# EAGLE design supervisor (EAGLE 5.11)
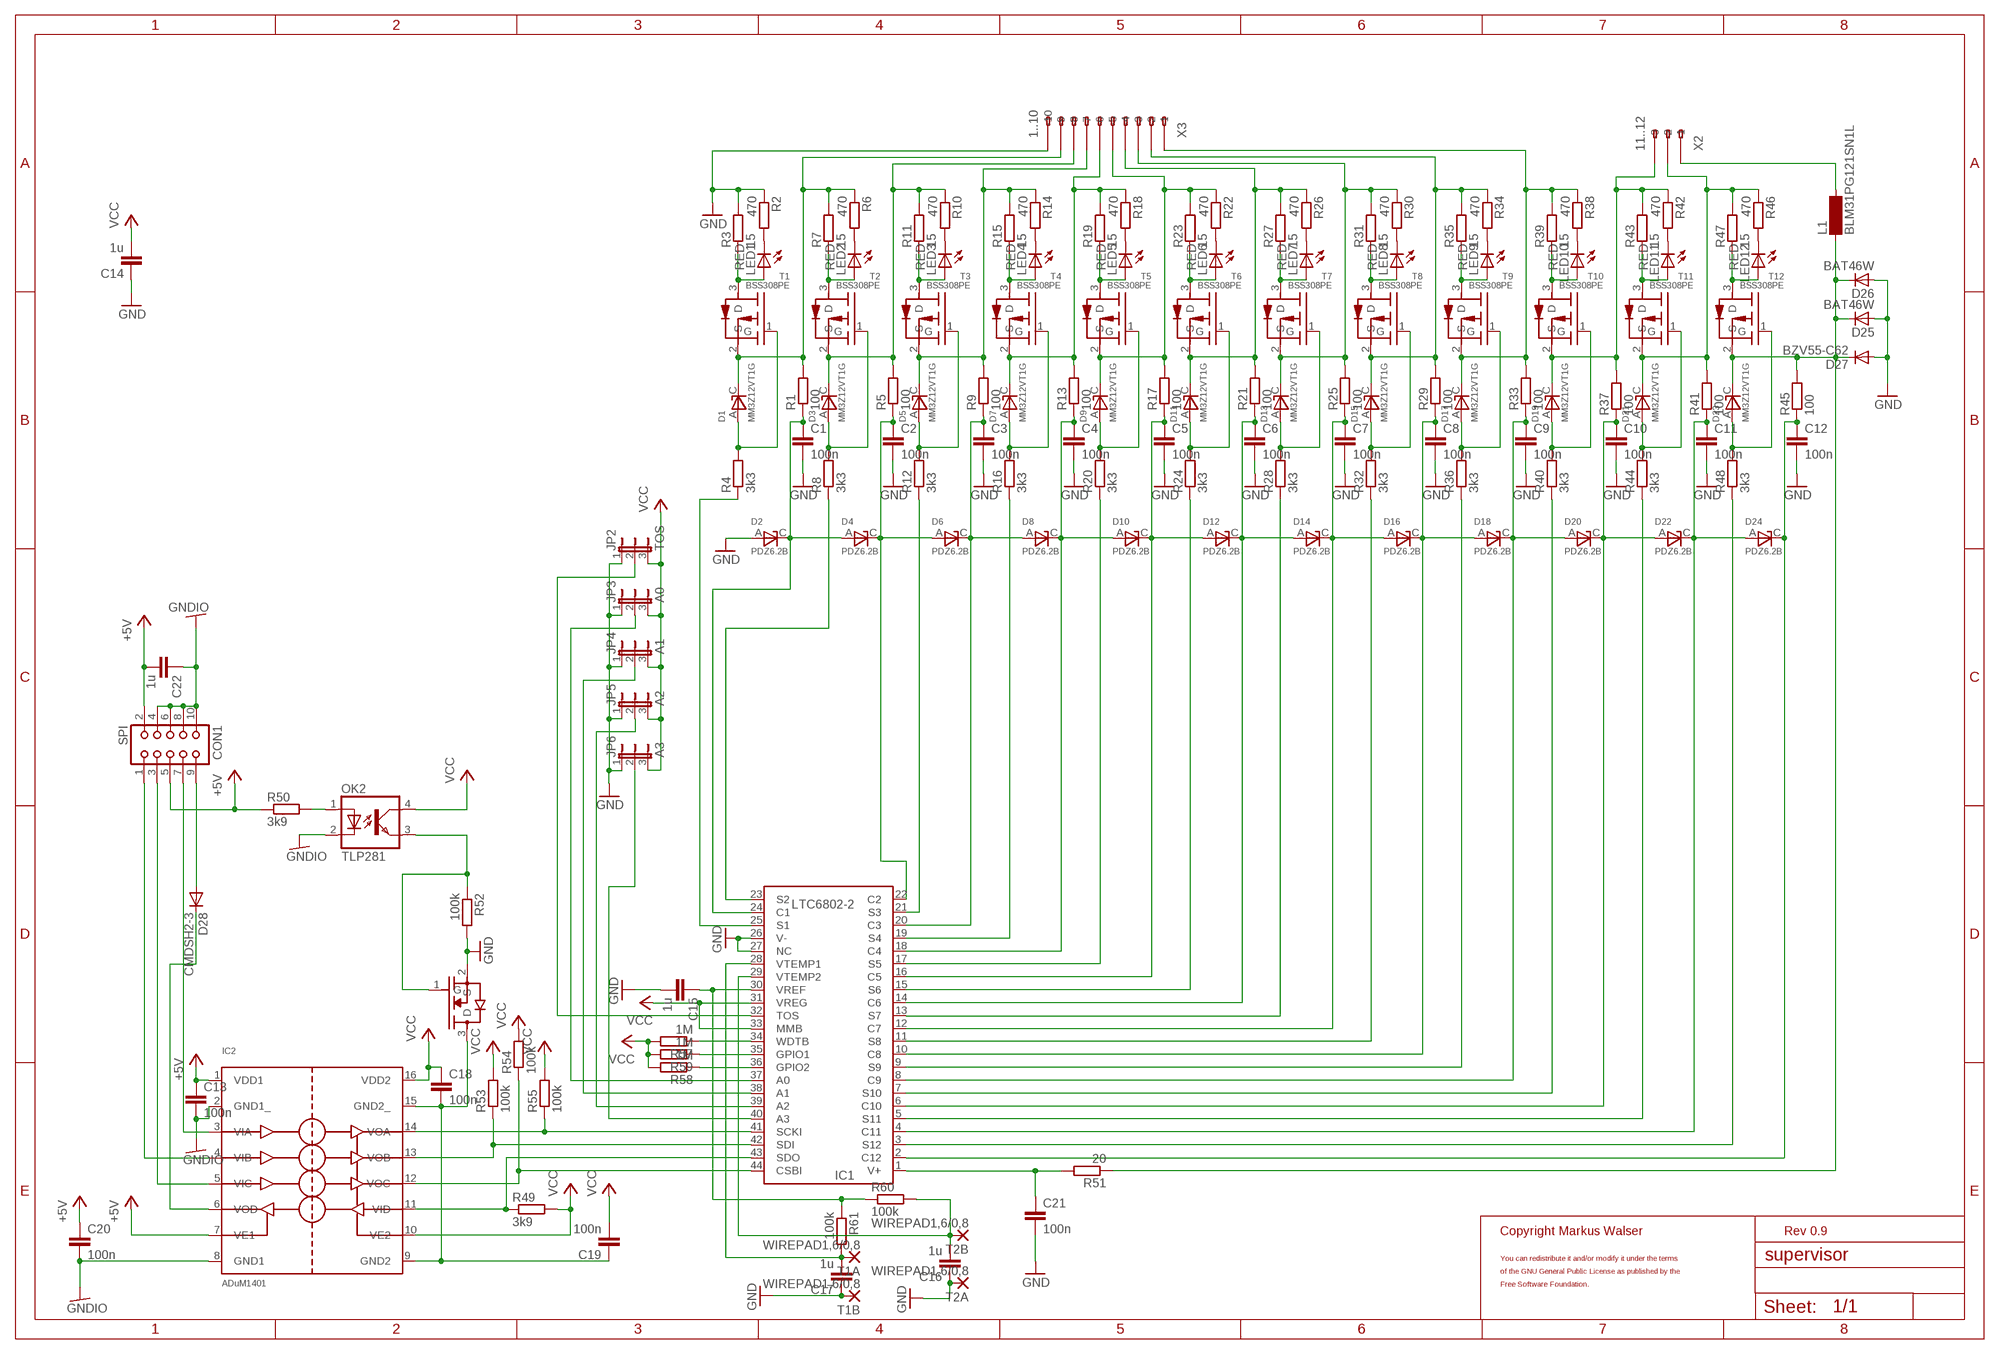
[diagram p0: schematic, sheet 1]

## Parts
C1  100n  C-EUC0603  [C0603]
C2  100n  C-EUC0603  [C0603]
C3  100n  C-EUC0603  [C0603]
C4  100n  C-EUC0603  [C0603]
C5  100n  C-EUC0603  [C0603]
C6  100n  C-EUC0603  [C0603]
C7  100n  C-EUC0603  [C0603]
C8  100n  C-EUC0603  [C0603]
C9  100n  C-EUC0603  [C0603]
C10  100n  C-EUC0603  [C0603]
C11  100n  C-EUC0603  [C0603]
C12  100n  C-EUC0603  [C0603]
C13  100n  C-EUC0603  [C0603]
C14  1u  C-EUC0603  [C0603]
C15  1u  C-EUC0603  [C0603]
C16  1u  C-EUC0603  [C0603]
C17  1u  C-EUC0603  [C0603]
C18  100n  C-EUC0603  [C0603]
C19  100n  C-EUC0603  [C0603]
C20  100n  C-EUC0603  [C0603]
C21  100n  C-EUC0603  [C0603]
C22  1u  C-EUC0603  [C0603]
CON1  SPI  CON10  [CON10]
D1  MM3Z12VT1G  MM3Z12VT1  [SOD323-R]
D2  PDZ6.2B  BZT52C6V2S  [SOD323-R]
D3  MM3Z12VT1G  MM3Z12VT1  [SOD323-R]
D4  PDZ6.2B  BZT52C6V2S  [SOD323-R]
D5  MM3Z12VT1G  MM3Z12VT1  [SOD323-R]
D6  PDZ6.2B  BZT52C6V2S  [SOD323-R]
D7  MM3Z12VT1G  MM3Z12VT1  [SOD323-R]
D8  PDZ6.2B  BZT52C6V2S  [SOD323-R]
D9  MM3Z12VT1G  MM3Z12VT1  [SOD323-R]
D10  PDZ6.2B  BZT52C6V2S  [SOD323-R]
D11  MM3Z12VT1G  MM3Z12VT1  [SOD323-R]
D12  PDZ6.2B  BZT52C6V2S  [SOD323-R]
D13  MM3Z12VT1G  MM3Z12VT1  [SOD323-R]
D14  PDZ6.2B  BZT52C6V2S  [SOD323-R]
D15  MM3Z12VT1G  MM3Z12VT1  [SOD323-R]
D16  PDZ6.2B  BZT52C6V2S  [SOD323-R]
D17  MM3Z12VT1G  MM3Z12VT1  [SOD323-R]
D18  PDZ6.2B  BZT52C6V2S  [SOD323-R]
D19  MM3Z12VT1G  MM3Z12VT1  [SOD323-R]
D20  PDZ6.2B  BZT52C6V2S  [SOD323-R]
D21  MM3Z12VT1G  MM3Z12VT1  [SOD323-R]
D22  PDZ6.2B  BZT52C6V2S  [SOD323-R]
D23  MM3Z12VT1G  MM3Z12VT1  [SOD323-R]
D24  PDZ6.2B  BZT52C6V2S  [SOD323-R]
D25  BAT46W  D-SOD123  [SOD123]
D26  BAT46W  D-SOD123  [SOD123]
D27  BZV55-C62  DIODE-MINIMELF  [MINIMELF]
D28  CMDSH2-3  DIODE-SOD323-R  [SOD323-R]
IC1  LTC6802-2  [SSOP44DL]
IC2  ADuM1401  ADUM1401  [SO16W]
JP2  TOS  JP2E  [JP2]
JP3  A0  JP2E  [JP2]
JP4  A1  JP2E  [JP2]
JP5  A2  JP2E  [JP2]
JP6  A3  JP2E  [JP2]
L1  BLM31PG121SN1L  SM-1206  [SM-1206]
LED1  RED  LEDCHIPLED_0805  [CHIPLED_0805]
LED2  RED  LEDCHIPLED_0805  [CHIPLED_0805]
LED3  RED  LEDCHIPLED_0805  [CHIPLED_0805]
LED4  RED  LEDCHIPLED_0805  [CHIPLED_0805]
LED5  RED  LEDCHIPLED_0805  [CHIPLED_0805]
LED6  RED  LEDCHIPLED_0805  [CHIPLED_0805]
LED7  RED  LEDCHIPLED_0805  [CHIPLED_0805]
LED8  RED  LEDCHIPLED_0805  [CHIPLED_0805]
LED9  RED  LEDCHIPLED_0805  [CHIPLED_0805]
LED10  RED  LEDCHIPLED_0805  [CHIPLED_0805]
LED11  RED  LEDCHIPLED_0805  [CHIPLED_0805]
LED12  RED  LEDCHIPLED_0805  [CHIPLED_0805]
OK2  TLP281  TLP283  [MINI-FLAT-4]
R1  100  R-EU_R0603  [R0603]
R2  470  R-EU_R0603  [R0603]
R3  15  R-EU_0411/12  [0411/12]
R4  3k3  R-EU_R0603  [R0603]
R5  100  R-EU_R0603  [R0603]
R6  470  R-EU_R0603  [R0603]
R7  15  R-EU_0411/12  [0411/12]
R8  3k3  R-EU_R0603  [R0603]
R9  100  R-EU_R0603  [R0603]
R10  470  R-EU_R0603  [R0603]
R11  15  R-EU_0411/12  [0411/12]
R12  3k3  R-EU_R0603  [R0603]
R13  100  R-EU_R0603  [R0603]
R14  470  R-EU_R0603  [R0603]
R15  15  R-EU_0411/12  [0411/12]
R16  3k3  R-EU_R0603  [R0603]
R17  100  R-EU_R0603  [R0603]
R18  470  R-EU_R0603  [R0603]
R19  15  R-EU_0411/12  [0411/12]
R20  3k3  R-EU_R0603  [R0603]
R21  100  R-EU_R0603  [R0603]
R22  470  R-EU_R0603  [R0603]
R23  15  R-EU_0411/12  [0411/12]
R24  3k3  R-EU_R0603  [R0603]
R25  100  R-EU_R0603  [R0603]
R26  470  R-EU_R0603  [R0603]
R27  15  R-EU_0411/12  [0411/12]
R28  3k3  R-EU_R0603  [R0603]
R29  100  R-EU_R0603  [R0603]
R30  470  R-EU_R0603  [R0603]
R31  15  R-EU_0411/12  [0411/12]
R32  3k3  R-EU_R0603  [R0603]
R33  100  R-EU_R0603  [R0603]
R34  470  R-EU_R0603  [R0603]
R35  15  R-EU_0411/12  [0411/12]
R36  3k3  R-EU_R0603  [R0603]
R37  100  R-EU_R0603  [R0603]
R38  470  R-EU_R0603  [R0603]
R39  15  R-EU_0411/12  [0411/12]
R40  3k3  R-EU_R0603  [R0603]
R41  100  R-EU_R0603  [R0603]
R42  470  R-EU_R0603  [R0603]
R43  15  R-EU_0411/12  [0411/12]
R44  3k3  R-EU_R0603  [R0603]
R45  100  R-EU_R0603  [R0603]
R46  470  R-EU_R0603  [R0603]
R47  15  R-EU_0411/12  [0411/12]
R48  3k3  R-EU_R0603  [R0603]
R49  3k9  R-EU_R0402  [R0402]
R50  3k9  R-EU_R0402  [R0402]
R51  20  R-EU_R0603  [R0603]
R52  100k  R-EU_R0402  [R0402]
R53  100k  R-EU_R0402  [R0402]
R54  100k  R-EU_R0402  [R0402]
R55  100k  R-EU_R0402  [R0402]
R57  1M  R-EU_R0402  [R0402]
R58  1M  R-EU_R0402  [R0402]
R59  1M  R-EU_R0402  [R0402]
R60  100k  R-EU_R0402  [R0402]
R61  100k  R-EU_R0402  [R0402]
T1  BSS308PE  SI2351DS  [SOT23]
T1A  WIREPAD1,6/0,8  [1,6/0,8]
T1B  WIREPAD1,6/0,8  [1,6/0,8]
T2  BSS308PE  SI2351DS  [SOT23]
T2A  WIREPAD1,6/0,8  [1,6/0,8]
T2B  WIREPAD1,6/0,8  [1,6/0,8]
T3  BSS308PE  SI2351DS  [SOT23]
T4  BSS308PE  SI2351DS  [SOT23]
T5  BSS308PE  SI2351DS  [SOT23]
T6  BSS308PE  SI2351DS  [SOT23]
T7  BSS308PE  SI2351DS  [SOT23]
T8  BSS308PE  SI2351DS  [SOT23]
T9  BSS308PE  SI2351DS  [SOT23]
T10  BSS308PE  SI2351DS  [SOT23]
T11  BSS308PE  SI2351DS  [SOT23]
T12  BSS308PE  SI2351DS  [SOT23]
T13  PMV30UN  FDN337N  [SOT23]
X2  11..12  233-503  [233-503]
X3  1..10  233-510  [233-510]

## Nets
+5V: C13.1 C20.1 C22.2 CON1.2 CON1.5 IC2.1(VDD1) IC2.7(VE1) R50.1
GND: C1.2 C2.2 C3.2 C4.2 C5.2 C6.2 C7.2 C8.2 C9.2 C10.2 C11.2 C12.2 C14.1 C15.2 C16.1 C17.1 C21.2 D2.A D25.2(A) D26.2(A) D27.A IC1.26(V-) IC1.27(NC) JP2.1 JP3.1 JP4.1 JP5.1 JP6.1 R2.1 R3.2 R52.2 T1B.1(P) T2A.1(P) T13.2(S) X3.A10(-10)
GNDIO: C13.2 C20.2 C22.1 CON1.4 CON1.6 CON1.8 CON1.10 IC2.2(GND1_) IC2.8(GND1) OK2.2(C)
N$1: LED1.C R2.2
N$2: D1.A R4.2 T1.1(G)
N$3: LED1.A R3.1 T1.3(D)
N$4: C1.1 D2.C(K) D4.A IC1.24(C1) R1.1
N$5: D1.C(K) R1.2 R6.1 R7.2 T1.2(S) X3.A9(-9)
N$6: C2.1 D4.C(K) D6.A IC1.22(C2) R5.1
N$7: C17.2 IC1.28(VTEMP1) R61.2 T1A.1(P)
N$8: IC1.23(S2) R8.1
N$9: C5.1 D10.C(K) D12.A IC1.16(C5) R17.1
N$10: D3.A R8.2 T2.1(G)
N$11: LED2.A R7.1 T2.3(D)
N$12: LED2.C R6.2
N$13: D3.C(K) R5.2 R10.1 R11.2 T2.2(S) X3.A8(-8)
N$14: C3.1 D6.C(K) D8.A IC1.20(C3) R9.1
N$15: IC1.21(S3) R12.1
N$16: IC1.17(S5) R20.1
N$17: D5.A R12.2 T3.1(G)
N$18: LED3.A R11.1 T3.3(D)
N$19: LED3.C R10.2
N$20: D5.C(K) R9.2 R14.1 R15.2 T3.2(S) X3.A7(-7)
N$21: IC1.34(WDTB) R57.1
N$22: IC1.19(S4) R16.1
N$23: D9.A R20.2 T5.1(G)
N$24: D7.A R16.2 T4.1(G)
N$25: LED4.A R15.1 T4.3(D)
N$26: LED4.C R14.2
N$27: D7.C(K) R13.2 R18.1 R19.2 T4.2(S) X3.A6(-6)
N$28: C4.1 D8.C(K) D10.A IC1.18(C4) R13.1
N$29: LED5.A R19.1 T5.3(D)
N$30: LED5.C R18.2
N$31: D9.C(K) R17.2 R22.1 R23.2 T5.2(S) X3.A5(-5)
N$32: C15.1 IC1.30(VREF) R60.1 R61.1
N$33: C6.1 D12.C(K) D14.A IC1.14(C6) R21.1
N$34: IC1.15(S6) R24.1
N$35: D11.A R24.2 T6.1(G)
N$36: LED6.A R23.1 T6.3(D)
N$37: LED6.C R22.2
N$38: D11.C(K) R21.2 R26.1 R27.2 T6.2(S) X3.A4(-4)
N$39: C16.2 IC1.29(VTEMP2) R60.2 T2B.1(P)
N$40: C7.1 D14.C(K) D16.A IC1.12(C7) R25.1
N$41: IC1.13(S7) R28.1
N$42: D13.A R28.2 T7.1(G)
N$43: LED7.A R27.1 T7.3(D)
N$44: LED7.C R26.2
N$45: D13.C(K) R25.2 R30.1 R31.2 T7.2(S) X3.A3(-3)
N$46: IC1.37(A0) JP3.2
N$47: C8.1 D16.C(K) D18.A IC1.10(C8) R29.1
N$48: IC1.11(S8) R32.1
N$49: D15.A R32.2 T8.1(G)
N$50: LED8.A R31.1 T8.3(D)
N$51: LED8.C R30.2
N$52: D15.C(K) R29.2 R34.1 R35.2 T8.2(S) X3.A2(-2)
N$53: IC1.38(A1) JP4.2
N$54: C9.1 D18.C(K) D20.A IC1.8(C9) R33.1
N$55: IC1.9(S9) R36.1
N$56: D17.A R36.2 T9.1(G)
N$57: LED9.A R35.1 T9.3(D)
N$58: LED9.C R34.2
N$59: D17.C(K) R33.2 R38.1 R39.2 T9.2(S) X3.A1(-1)
N$60: IC1.39(A2) JP5.2
N$61: C10.1 D20.C(K) D22.A IC1.6(C10) R37.1
N$62: IC1.7(S10) R40.1
N$63: D19.A R40.2 T10.1(G)
N$64: LED10.A R39.1 T10.3(D)
N$65: LED10.C R38.2
N$66: D19.C(K) R37.2 R42.1 R43.2 T10.2(S) X2.A3(-3)
N$67: IC1.40(A3) JP6.2
N$68: C11.1 D22.C(K) D24.A IC1.4(C11) R41.1
N$69: IC1.5(S11) R44.1
N$70: D21.A R44.2 T11.1(G)
N$71: LED11.A R43.1 T11.3(D)
N$72: LED11.C R42.2
N$74: IC1.43(SDO) IC2.11(VID) R49.1
N$75: C12.1 D24.C(K) IC1.2(C12) R45.1
N$76: IC1.3(S12) R48.1
N$77: D23.A R48.2 T12.1(G)
N$78: LED12.A R47.1 T12.3(D)
N$79: LED12.C R46.2
N$80: L1.2 X2.A1(-1)
N$81: IC1.44(CSBI) IC2.12(VOC) R54.1
N$82: IC1.42(SDI) IC2.13(VOB) R53.1
N$83: IC1.41(SCKI) IC2.14(VOA) R55.1
N$84: D21.C(K) R41.2 R46.1 R47.2 T11.2(S) X2.A2(-2)
N$85: IC1.32(TOS) JP2.2
N$86: C18.2 C19.1 IC2.9(GND2) IC2.15(GND2_) T13.3(D)
N$87: IC1.35(GPIO1) R59.1
N$88: IC1.36(GPIO2) R58.1
N$89: OK2.3(EMIT) R52.1 T13.1(G)
N$90: D28.C IC2.6(VOD)
N$92: CON1.7 IC2.3(VIA)
N$93: CON1.3 IC2.5(VIC)
N$94: CON1.1 IC2.4(VIB)
N$95: CON1.9 D28.A
N$96: OK2.1(A) R50.2
N$98: C21.1 IC1.1(V+) R51.2
N$100: D23.C(K) D25.1(C) D26.1(C) D27.C L1.1 R45.2 R51.1 T12.2(S)
N$103: IC1.25(S1) R4.1
VCC: C14.2 C18.1 C19.2 IC1.31(VREG) IC1.33(MMB) IC2.10(VE2) IC2.16(VDD2) JP2.3 JP3.3 JP4.3 JP5.3 JP6.3 OK2.4(COL) R49.2 R53.2 R54.2 R55.2 R57.2 R58.2 R59.2
Unconnected: X2.B1(B-1) X2.B2(B-2) X2.B3(B-3) X3.B1(B-1) X3.B2(B-2) X3.B3(B-3) X3.B4(B-4) X3.B5(B-5) X3.B6(B-6) X3.B7(B-7) X3.B8(B-8) X3.B9(B-9) X3.B10(B-10)

## Notes on the sheet
- Copyright Markus Walser | Rev 0.9
- You can redistribute it and/or modify it under the terms
- of the GNU General Public License as published by the
- Free Software Foundation.

## Library data of the parts
C1-C22 = resistor:C-EU: CAPACITOR, European symbol
CON1 = con-harting:CON10: CONNECTOR; OC_FARNELL: unknown; OC_NEWARK: unknown
D1 D3 D5 D7 D9 D11 D13 D15 D17 D19 D21 D23 = icontroller:MM3Z12VT1: 12V Z-Diode
D2 D4 D6 D8 D10 D12 D14 D16 D18 D20 D22 D24 = icontroller:BZT52C6V2S: 6.2V Z-Diode
D25 D26 = semicon-smd-ipc:D-: DIODE unfilled
D27 D28 = diode:DIODE-: DIODE
IC1 = ltc6802:LTC6802-2: LTC6802-2 The LTC®6802-2 is a complete battery monitoring IC that includes a 12-bit ADC, a precision voltage reference, a high voltage input multiplexer and a serial interface. Each LTC6802-2 can measure 12 series connected battery cells, with a total input voltage up to 60V. The voltage on all 12 input channels can be measured within 13ms. Many LTC6802-2 devices can be stacked to measure the voltage of each cell in a long battery string. Each LTC6802-2 has an individually addressable serial interface, allowing up to 16 LTC6802-2 devices to interface to one control processor and operate simultaneously. To minimize power, the LTC6802-2 offers a measure mode to monitor each cell for overvoltage and undervoltage conditions. A standby mode is also provided to reduce supply current to 50µA. Each cell input has an associated MOSFET switch that can discharge any overcharged cell. The related LTC6802-1 offers a serial interface that allows the serial ports of multiple LTC6802-1 devices to be daisy chained without opto-couplers or isolators.
IC2 = spisolator:ADUM1401: Quad-Channel Digital Isolators The ADuM1401 is a 3/1 quad-channel digital isolators based on Analog Devices, Inc., iCoupler® technology. Combining high speed CMOS and monolithic air core transformer technology, these isolation components provide outstanding performance characteristics superior to alternatives, such as optocoupler devices.
JP2-JP6 = jumper:JP2E: JUMPER
L1 = inductor-neosid:SM-1206: INDUCTOR SMD chip inductor
LED1-LED12 = led:LED: LED OSRAM: - CHIPLED LG R971, LG N971, LY N971, LG Q971, LY Q971, LO R971, LY R971 LH N974, LH R974 LS Q976, LO Q976, LY Q976 LO Q996 - Hyper CHIPLED LW Q18S LB Q993, LB Q99A, LB R99A - SideLED LS A670, LO A670, LY A670, LG A670, LP A670 LB A673, LV A673, LT A673, LW A673 LH A674 LY A675 LS A676, LA A676, LO A676, LY A676, LW A676 LS A679, LY A679, LG A679 - Hyper Micro SIDELED® LS Y876, LA Y876, LO Y876, LY Y876 LT Y87S - SmartLED LW L88C, LW L88S LB L89C, LB L89S, LG L890 LS L89K, LO L89K, LY L89K LS L896, LA L896, LO L896, LY L896 - TOPLED LS T670, LO T670, LY T670, LG T670, LP T670 LSG T670, LSP T670, LSY T670, LOP T670, LYG T670 LG T671, LOG T671, LSG T671 LB T673, LV T673, LT T673, LW T673 LH T674 LS T676, LA T676, LO T676, LY T676, LB T676, LH T676, LSB T676, LW T676 LB T67C, LV T67C, LT T67C, LS T67K, LO T67K, LY T67K, LW E67C LS E67B, LA E67B, LO E67B, LY E67B, LB E67C, LV E67C, LT E67C LW T67C LS T679, LY T679, LG T679 LS T770, LO T770, LY T770, LG T770, LP T770 LB T773, LV T773, LT T773, LW T773 LH T774 LS E675, LA E675, LY E675, LS T675 LS T776, LA T776, LO T776, LY T776, LB T776 LHGB T686 LT T68C, LB T68C - Hyper Mini TOPLED® LB M676 - Mini TOPLED Santana® LG M470 LS M47K, LO M47K, LY M47K Source: http://www.osram.convergy.de LUXEON: - LUMILED® LXK2-PW12-R00, LXK2-PW12-S00, LXK2-PW14-U00, LXK2-PW14-V00 LXK2-PM12-R00, LXK2-PM12-S00, LXK2-PM14-U00 LXK2-PE12-Q00, LXK2-PE12-R00, LXK2-PE12-S00, LXK2-PE14-T00, LXK2-PE14-U00 LXK2-PB12-K00, LXK2-PB12-L00, LXK2-PB12-M00, LXK2-PB14-N00, LXK2-PB14-P00, LXK2-PB14-Q00 LXK2-PR12-L00, LXK2-PR12-M00, LXK2-PR14-Q00, LXK2-PR14-R00 LXK2-PD12-Q00, LXK2-PD12-R00, LXK2-PD12-S00 LXK2-PH12-R00, LXK2-PH12-S00 LXK2-PL12-P00, LXK2-PL12-Q00, LXK2-PL12-R00 Source: www.luxeon.com KINGBRIGHT: KA-3528ASYC Source: www.kingbright.com
OK2 = optocoupler:TLP283: TOSHIBA PHOTOCOUPLER GaAs IRED & PHOTO-TRANSISTOR Source: http://www.semicon.toshiba.co.jp/td/en/Opto/Photocoupler/en_20050928_TLP283_datasheet.pdf; OC_FARNELL: unknown; OC_NEWARK: unknown
R1-R48 R51 = resistor:R-EU_: RESISTOR, European symbol
R49 R50 R52-R55 R57-R61 = rcl:R-EU_: RESISTOR, European symbol
T1-T12 = icontroller:SI2351DS
T1A T1B T2A T2B = wirepad:WIREPAD: Wire PAD connect wire on PCB
T13 = ltc6802:FDN337N: N-Channel Logic Level Enhancement Mode Field Effect Transistor
X2 = con-wago:233-503: WAGO Cage Clamp
X3 = con-wago:233-510: WAGO Cage Clamp

## Board
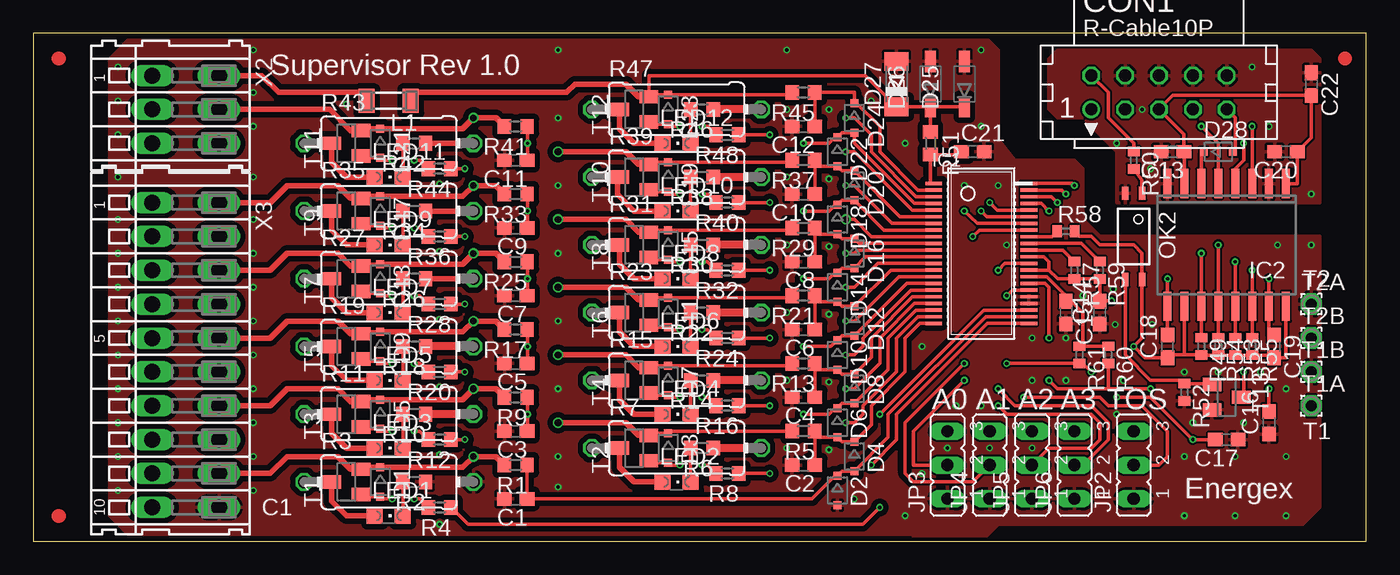
[diagram p1: board, top side]
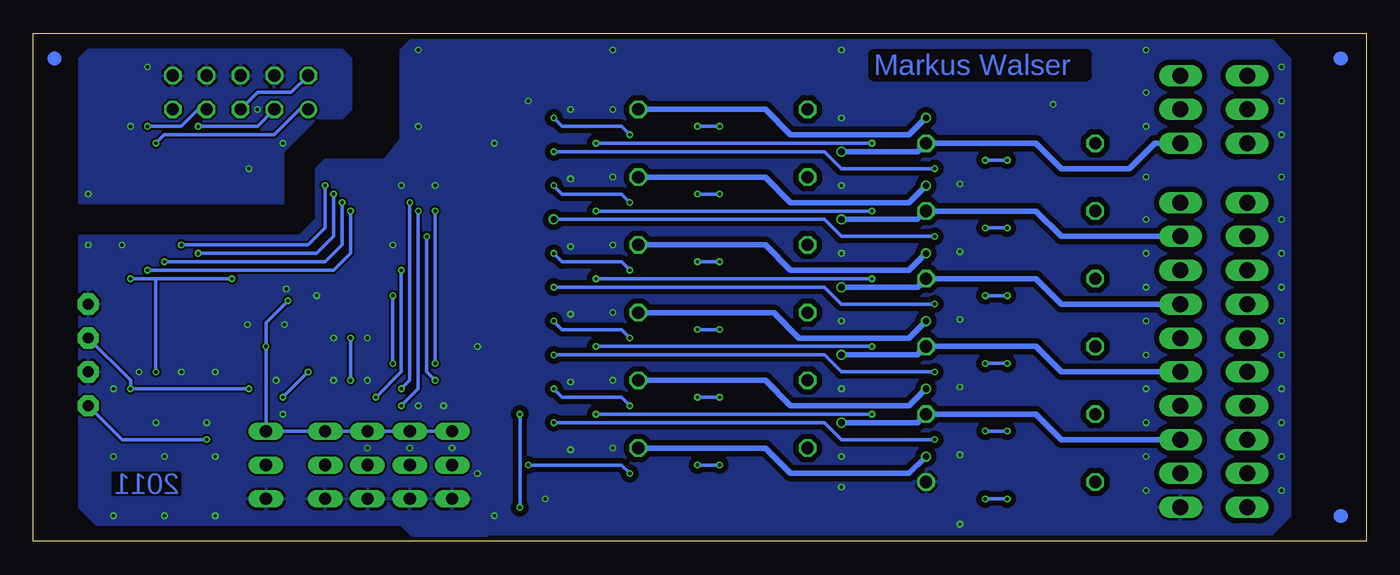
[diagram p2: board, bottom side, seen from below]

Size 100 x 38.09 mm. Coordinates in mm from the lower left corner, seen from the top.
Outline: 0,0 100,0 100,38.09 0,38.09 0,0
Copper layers (1*16): Top 0.035mm / dielectric 1.5mm / Bottom 0.035mm
Design rules "PCB-POOL HighSpec *": minimum track width 0.125mm, minimum drill 0.2mm, track to track 0.125mm, track to pad 0.125mm, pad to pad 0.125mm, via to via 0.125mm, smd to smd 0.125mm, copper to edge 0.3mm, drill to drill 0.2mm, minimum pad ring 0.2mm, minimum via ring 0.125mm, stop-mask expansion 0.075mm, vias tented up to drill 20mil, thermal gap 0.2mm

### Footprints (pad centres in the part's own frame; a part is rotated, then mirrored left to right if it is on the bottom)
C0603 = smd 1.1 x 1: 1 -0.85,0; 2 0.85,0
CON10 = drill 0.914 round: 1 -5.08,-1.27 | drill 0.914 octagon: 2 -5.08,1.27; 3 -2.54,-1.27; 4 -2.54,1.27; 5 0,-1.27; 6 0,1.27; 7 2.54,-1.27; 8 2.54,1.27; 9 5.08,-1.27; 10 5.08,1.27
SOD323-R = smd 0.6 x 0.6: A 1.1,0; C -1.1,0
SOD123 = smd 1.6 x 0.8: 1 -1.7,0; 2 1.7,0
MINIMELF = smd 1.4 x 1.8: A 1.7,0; C -1.7,0
SSOP44DL = smd 0.25 x 1.25: 1 -5.25,-3.575; 2 -4.75,-3.575; 3 -4.25,-3.575; 4 -3.75,-3.575; 5 -3.25,-3.575; 6 -2.75,-3.575; 7 -2.25,-3.575; 8 -1.75,-3.575; 9 -1.25,-3.575; 10 -0.75,-3.575; 11 -0.25,-3.575; 12 0.25,-3.575; 13 0.75,-3.575; 14 1.25,-3.575; 15 1.75,-3.575; 16 2.25,-3.575; 17 2.75,-3.575; 18 3.25,-3.575; 19 3.75,-3.575; 20 4.25,-3.575; 21 4.75,-3.575; 22 5.25,-3.575; 23 5.25,3.575; 24 4.75,3.575; 25 4.25,3.575; 26 3.75,3.575; 27 3.25,3.575; 28 2.75,3.575; 29 2.25,3.575; 30 1.75,3.575; 31 1.25,3.575; 32 0.75,3.575; 33 0.25,3.575; 34 -0.25,3.575; 35 -0.75,3.575; 36 -1.25,3.575; 37 -1.75,3.575; 38 -2.25,3.575; 39 -2.75,3.575; 40 -3.25,3.575; 41 -3.75,3.575; 42 -4.25,3.575; 43 -4.75,3.575; 44 -5.25,3.575
SO16W = smd 0.6 x 2.2: 1 -4.445,-4.6; 2 -3.175,-4.6; 3 -1.905,-4.6; 4 -0.635,-4.6; 5 0.635,-4.6; 6 1.905,-4.6; 7 3.175,-4.6; 8 4.445,-4.6; 9 4.445,4.6; 10 3.175,4.6; 11 1.905,4.6; 12 0.635,4.6; 13 -0.635,4.6; 14 -1.905,4.6; 15 -3.175,4.6; 16 -4.445,4.6
JP2 = drill 0.914 long: 1 -2.54,0; 2 0,0; 3 2.54,0
SM-1206 = smd 1.2 x 1.8: 1 -1.65,0; 2 1.65,0
CHIPLED_0805 = smd 1.2 x 1.2: A 0,-1.05; C 0,1.05
MINI-FLAT-4 = smd 1 x 0.5: 1 -3.24,0.635; 2 -3.24,-0.635; 3 3.24,-0.635; 4 3.24,0.635
R0603 = smd 1 x 1.1: 1 -0.85,0; 2 0.85,0
0411/12 = drill 0.914 octagon: 1 -6.35,0; 2 6.35,0
R0402 = smd 0.7 x 0.9: 1 -0.65,0; 2 0.65,0
SOT23 = smd 1 x 1.4: 1 -0.95,-1.1; 2 0.95,-1.1; 3 0,1.1
1,6/0,8 = drill 0.813 pad 1.6 octagon: 1 0,0
233-503 = drill 1.2 long: A1 -2.54,2.5; A2 0,2.5; A3 2.54,2.5; B1 -2.54,-2.5; B2 0,-2.5; B3 2.54,-2.5
233-510 = drill 1.2 long: A1 -11.43,2.5; A2 -8.89,2.5; A3 -6.35,2.5; A4 -3.81,2.5; A5 -1.27,2.5; A6 1.27,2.5; A7 3.81,2.5; A8 6.35,2.5; A9 8.89,2.5; A10 11.43,2.5; B1 -11.43,-2.5; B2 -8.89,-2.5; B3 -6.35,-2.5; B4 -3.81,-2.5; B5 -1.27,-2.5; B6 1.27,-2.5; B7 3.81,-2.5; B8 6.35,-2.5; B9 8.89,-2.5; B10 11.43,-2.5

### Placement (x,y rotation side)
C1  36.2,3.17 180 top
C2  57.78,5.71 180 top
C3  36.2,8.26 180 top
C4  57.78,10.79 180 top
C5  36.2,13.34 180 top
C6  57.78,15.88 180 top
C7  36.2,18.41 180 top
C8  57.78,20.95 180 top
C9  36.2,23.5 180 top
C10  57.78,26.04 180 top
C11  36.2,28.57 180 top
C12  57.78,31.11 180 top
C13  85.47,29.21 180 top
C14  80.01,17.14 90 top
C15  77.47,17.14 270 top
C16  92.71,8.89 90 top
C17  89.53,7.62 180 top
C18  85.09,14.61 90 top
C19  93.09,14.61 270 top
C20  93.98,29.21 180 top
C21  70.48,29.21 0 top
C22  95.89,34.29 270 top
CON1  84.45,33.66 0 top
D1  26.04,4.45 270 top
D2  60.33,3.81 270 top
D3  47.62,6.99 270 top
D4  61.59,6.35 270 top
D5  26.04,9.53 270 top
D6  60.33,8.89 270 top
D7  47.62,12.06 270 top
D8  61.59,11.43 270 top
D9  26.04,14.61 270 top
D10  60.33,13.97 270 top
D11  47.62,17.14 270 top
D12  61.59,16.51 270 top
D13  26.04,19.68 270 top
D14  60.33,19.05 270 top
D15  47.62,22.23 270 top
D16  61.59,21.59 270 top
D17  26.04,24.77 270 top
D18  60.33,24.13 270 top
D19  47.62,27.3 270 top
D20  61.59,26.67 270 top
D21  26.04,29.84 270 top
D22  60.33,29.21 270 top
D23  47.62,32.38 270 top
D24  61.59,31.75 270 top
D25  69.85,34.29 90 top
D26  67.31,34.29 90 top
D27  64.77,34.29 90 top
D28  88.9,29.21 0 top
IC1  71.12,21.59 270 top
IC2  89.53,22.23 180 top
JP2  82.55,5.71 90 top
JP3  68.58,5.71 90 top
JP4  71.75,5.71 90 top
JP5  74.93,5.71 90 top
JP6  78.11,5.71 90 top
L1  26.67,33.02 180 top
LED1  26.67,1.91 270 top
LED2  48.26,4.45 270 top
LED3  26.67,6.99 270 top
LED4  48.26,9.53 270 top
LED5  26.67,12.06 270 top
LED6  48.26,14.61 270 top
LED7  26.67,17.14 270 top
LED8  48.26,19.68 270 top
LED9  26.67,22.23 270 top
LED10  48.26,24.77 270 top
LED11  26.67,27.3 270 top
LED12  48.26,29.84 270 top
OK2  82.55,22.86 270 top
R1  36.2,5.71 180 top
R2  28.57,4.45 180 top
R3  26.67,4.45 0 top
R4  30.48,2.54 180 top
R5  57.78,8.26 180 top
R6  50.16,6.99 180 top
R7  48.26,6.99 0 top
R8  52.07,5.08 180 top
R9  36.2,10.79 180 top
R10  28.57,9.53 180 top
R11  26.67,9.53 0 top
R12  30.48,7.62 180 top
R13  57.78,13.34 180 top
R14  50.16,12.06 180 top
R15  48.26,12.06 0 top
R16  52.07,10.16 180 top
R17  36.2,15.88 180 top
R18  28.57,14.61 180 top
R19  26.67,14.61 0 top
R20  30.48,12.7 180 top
R21  57.78,18.41 180 top
R22  50.16,17.14 180 top
R23  48.26,17.14 0 top
R24  52.07,15.24 180 top
R25  36.2,20.95 180 top
R26  28.57,19.68 180 top
R27  26.67,19.68 0 top
R28  30.48,17.78 180 top
R29  57.78,23.5 180 top
R30  50.16,22.23 180 top
R31  48.26,22.23 0 top
R32  52.07,20.32 180 top
R33  36.2,26.04 180 top
R34  28.57,24.77 180 top
R35  26.67,24.77 0 top
R36  30.48,22.86 180 top
R37  57.78,28.57 180 top
R38  50.16,27.3 180 top
R39  48.26,27.3 0 top
R40  52.07,25.4 180 top
R41  36.2,31.11 180 top
R42  28.57,29.84 180 top
R43  26.67,29.84 0 top
R44  30.48,27.94 180 top
R45  57.78,33.66 180 top
R46  50.16,32.38 180 top
R47  48.26,32.38 0 top
R48  52.07,30.48 180 top
R49  87.63,14.61 270 top
R50  82.55,28.57 270 top
R51  67.31,29.84 270 top
R52  86.36,11.18 270 top
R53  90.17,14.61 270 top
R54  88.9,14.61 270 top
R55  91.44,14.61 270 top
R57  78.11,20.32 270 top
R58  77.47,23.24 0 top
R59  80.01,20.32 270 top
R60  80.64,13.97 270 top
R61  78.49,13.97 270 top
T1  23.5,4.45 90 top
T1A  95.89,10.16 0 top
T1B  95.89,12.7 0 top
T2  45.09,6.99 90 top
T2A  95.89,17.78 0 top
T2B  95.89,15.24 0 top
T3  23.5,9.53 90 top
T4  45.09,12.06 90 top
T5  23.5,14.61 90 top
T6  45.09,17.14 90 top
T7  23.5,19.68 90 top
T8  45.09,22.23 90 top
T9  23.5,24.77 90 top
T10  45.09,27.3 90 top
T11  23.5,29.84 90 top
T12  45.09,32.38 90 top
T13  89.53,10.79 270 top
X2  11.43,32.38 270 top
X3  11.43,13.97 270 top

### Tracks (layer width: path | path; a pad name or v marks a point on that pad's centre or on a via)
+5V
  Top 0.254: IC2.7 86.36,29 C13.1 86.32,30.52 CON1.5 85.51,33.44 C22.2 95.89,30.27 C20.1 94.83,26.82 IC2.1 | R50.1 82.55,29.84 80.64,31.75 80.64,33.66 CON1.2
  Bottom 0.254: CON1.2 80.64,33.66 83.19,33.66 CON1.5
GND  (via drill 0.25 pad 0.25)
  other vias: 16.51,27.3 16.51,36.83 71.75,6.99 86.36,1.91 69.85,26.67 6.35,35.56 6.35,33.02 6.35,30.48 6.35,27.3 6.35,24.13 6.35,21.59 6.35,19.05 6.35,16.51 6.35,13.97 6.35,11.43 6.35,8.89 6.35,6.35 6.35,3.81 16.51,31.11 72.39,26.67 90.17,1.91 93.98,1.91 74.93,6.99 39.37,36.83 71.12,10.16 81.28,9.53 69.22,10.16 68.58,6.99 77.47,12.06 16.51,8.89 16.51,13.97 16.51,19.05 16.51,24.13 16.51,21.59 16.51,16.51 16.51,11.43 16.51,6.35 56.52,17.14 56.52,12.06 56.52,6.99 56.52,22.23 56.52,27.3 56.52,32.38 39.37,6.35 39.37,11.43 39.37,16.51 39.37,21.59 39.37,26.67 39.37,31.75 16.51,33.66 65.41,29.84 62.87,33.02 74.93,15.24 81.79,12.06 77.47,15.24 16.51,3.81 56.52,36.83 71.12,36.83 71.12,31.11 65.41,1.91 61.59,3.17 66.67,14.61 86.36,12.7 90.81,8.89 93.98,11.43 93.34,22.23 92.08,12.7 90.17,6.35 86.36,6.35 93.98,6.35 88.9,12.7 59.69,11.94 59.69,17.02 59.69,6.86 59.69,22.1 59.69,27.18 59.69,32.38 30.48,6.48 30.48,11.56 30.48,16.64 30.48,21.72 30.48,26.8 30.48,1.27 78.74,18.41 81.03,18.92 83.95,16.26 95.89,22.23 23.5,32.77 66.67,5.08 39.37,4.06 87,8.89 74.93,12.06 81.15,16.26 73.03,22.23
  pour Bottom (isolate 0.152): 69.22,27.94 71.12,27.94 71.12,31.75 73.66,28.57 78.11,28.57 78.74,27.94 78.74,24.13 80.01,22.86 96.52,22.86 96.52,2.54 95.25,1.27 72.39,1.27 71.12,0 66.04,0 66.04,10.79 69.22,13.97
  pour Top (isolate 0.152): 69.22,27.94 71.12,27.94 71.12,31.75 73.66,28.57 78.11,28.57 78.74,27.94 78.74,24.13 80.01,22.86 96.52,22.86 96.52,2.54 95.25,1.27 72.39,1.27 71.12,0 66.04,0 66.04,10.79 69.22,13.97
  pour Top (isolate 0.406): 5.71,36.2 7.62,38.1 71.12,38.1 72.39,36.83 72.39,27.94 69.22,27.94 69.22,13.97 66.04,10.79 66.04,0 7.62,0 5.71,1.91
  pour Bottom (isolate 0.406): 5.71,36.2 7.62,38.1 71.12,38.1 72.39,36.83 72.39,27.94 69.22,27.94 69.22,13.97 66.04,10.79 66.04,0 7.62,0 5.71,1.91
GNDIO  (via drill 0.25)
  other vias: 91.44,35.56 83.19,32.38 81.28,29.84 95.89,26.04 92.71,31.11 83.82,27.94
  pour Bottom (isolate 0.152): 76.2,36.2 76.83,36.83 95.89,36.83 96.52,36.2 96.52,25.4 81.28,25.4 81.28,29.21 78.74,31.75 76.83,31.75 76.2,32.38
  pour Top (isolate 0.152): 76.83,31.75 76.2,32.38 76.2,36.2 76.83,36.83 95.89,36.83 96.52,36.2 96.52,25.4 81.28,25.4 81.28,29.21 78.74,31.75
N$1
  Top 0.254: R2.2 LED1.C
N$2  (via drill 0.25)
  Top 0.254: T1.1 24.75,3.35 D1.A 26.04,3.17 v26.92,3.17 | R4.2 29,3.17 v28.57,3.17
  Bottom 0.254: v26.92,3.17 v28.57,3.17
N$3
  Top 0.406: LED1.A 23.5,1.91 22.39,3 T1.3
  Top 0.61: R3.1 T1.3
N$4
  Top 0.254: IC1.24 71.45,16.84 64.14,9.53 64.14,7.79 D4.A 60.66,5.25 D2.C 60.16,4.91 58.42,3.17 C1.1 R1.1
N$5  (via drill 0.5)
  Top 0.254: T1.2 24.75,5.54
  Top 0.406: 24.75,5.54 D1.C 32.22,5.54 v33.02,6.35 34.71,6.35 R1.2 | T1.2 23.82,5.39 22.86,6.35 19.05,6.35 17.78,5.08 X3.A9
  Top 0.61: R7.2 R6.1
  Bottom 0.406: R7.2 45.09,6.99 43.18,5.08 34.29,5.08 v33.02,6.35
N$6
  Top 0.254: IC1.22 66.5,16.34 65.41,15.24 65.41,12.7 62.87,10.16 62.87,8.72 D4.C 60.66,7.45 D6.A 58.63,7.79 R5.1 C2.1
N$7  (via drill 0.25)
  Top 0.254: v81.28,10.79 83.82,10.79 v87,7.62 C17.2 | IC1.28 73.45,18.84 v73.03,18.41 | v79.38,12.7 78.75,13.32 R61.2 78.47,13.34 v73.03,13.34
  Bottom 0.254: v79.38,12.7 v81.28,10.79 | T1A.1 93.34,7.62 v87,7.62 | v73.03,13.34 v73.03,18.41
N$8  (via drill 0.25)
  Top 0.254: R8.1 v55.24,5.08 | v62.87,5.71 64.77,7.62 64.77,9.53 71.58,16.34 IC1.23
  Bottom 0.254: v55.24,5.08 55.88,5.71 v62.87,5.71
N$9  (via drill 0.25)
  Top 0.254: IC1.16 65.53,19.34 D12.A 60.66,15.41 D10.C 59.86,14.61 v57.78,14.61 | R17.1 37.08,15.58 v37.08,14.61 37.08,13.37 C5.1
  Bottom 0.254: v37.08,14.61 v57.78,14.61
N$10  (via drill 0.25)
  Top 0.254: T2.1 arc90 46.34,5.88 D3.A 47.62,5.71 v48.51,5.71 | R8.2 50.59,5.71 v50.16,5.71
  Bottom 0.254: v48.51,5.71 v50.16,5.71
N$11
  Top 0.406: LED2.A 45.09,4.45 43.98,5.54 T2.3
  Top 0.61: R7.1 T2.3
N$12
  Top 0.254: R6.2 49.31,6.34 LED2.C
N$13  (via drill 0.5)
  Top 0.254: T2.2 46.34,8.09 D3.C 47.8,8.26 R5.2
  Top 0.406: T2.2 45.41,7.93 44.45,8.89 v39.37,8.89
  Top 0.61: R11.2 R10.1
  Bottom 0.406: v39.37,8.89 33.66,8.89 R11.2 24.77,9.53 22.86,7.62 X3.A8
N$14  (via drill 0.25)
  Top 0.254: IC1.20 66.23,17.34 64.14,15.24 64.14,12.87 D8.A 60.66,10.33 D6.C 60.16,9.99 59.69,9.53 v57.78,9.53 | R9.1 37.08,10.63 v37.08,9.53 37.08,8.29 C3.1
  Bottom 0.254: v37.08,9.53 v57.78,9.53
N$15  (via drill 0.25)
  Top 0.254: IC1.21 66.37,16.84 64.77,15.24 64.77,12.7 62.23,10.16 62.23,9.53 61.59,8.89 v60.96,8.89 | R12.1 v32.38,7.62
  Bottom 0.254: v60.96,8.89 40.64,8.89 39.37,7.62 v32.38,7.62
N$16  (via drill 0.25)
  Top 0.254: IC1.17 65.83,18.84 62.23,15.24 62.23,14.61 61.59,13.97 v60.96,13.97 | R20.1 v32.38,12.7
  Bottom 0.254: v32.38,12.7 39.37,12.7 40.64,13.97 v60.96,13.97
N$17  (via drill 0.25)
  Top 0.254: T3.1 24.75,8.43 D5.A 26.04,8.26 v26.92,8.26 | R12.2 29,8.26 v28.57,8.26
  Bottom 0.254: v26.92,8.26 v28.57,8.26
N$18
  Top 0.406: T3.3 22.39,8.09 23.5,6.99 LED3.A
  Top 0.61: R11.1 T3.3
N$19
  Top 0.254: R10.2 LED3.C
N$20  (via drill 0.5)
  Top 0.254: T3.2 24.75,10.62
  Top 0.406: 24.75,10.62 D5.C 32.22,10.62 v33.02,11.43 34.71,11.43 R9.2 | X3.A7 17.78,10.16 19.05,11.43 22.86,11.43 23.82,10.47 T3.2
  Top 0.61: R15.2 R14.1
  Bottom 0.406: R15.2 45.09,12.06 43.18,10.16 34.29,10.16 v33.02,11.43
N$21
  Top 0.254: IC1.34 77.23,21.84 R57.1
N$22  (via drill 0.25)
  Top 0.254: IC1.19 66.1,17.84 63.5,15.24 63.5,13.34 61.59,11.43 v60.96,11.43 | R16.1 v55.24,10.16
  Bottom 0.254: v55.24,10.16 55.88,10.79 60.33,10.79 v60.96,11.43
N$23  (via drill 0.25)
  Top 0.254: T5.1 24.75,13.51 D9.A 26.04,13.34 v26.92,13.34 | R20.2 29,13.34 v28.57,13.34
  Bottom 0.254: v26.92,13.34 v28.57,13.34
N$24  (via drill 0.25)
  Top 0.254: T4.1 46.19,10.96 D7.A 47.62,10.79 v48.51,10.79 | R16.2 50.59,10.79 v50.16,10.79
  Bottom 0.254: v48.51,10.79 v50.16,10.79
N$25
  Top 0.406: LED4.A 45.09,9.53 43.98,10.62 T4.3
  Top 0.61: R15.1 T4.3
N$26
  Top 0.254: R14.2 49.31,11.43 LED4.C
N$27  (via drill 0.5)
  Top 0.254: R13.2 56.47,13.16 D7.C 46.34,13.16 T4.2
  Top 0.406: T4.2 45.41,13.02 44.45,13.97 v39.37,13.97
  Top 0.61: R19.2 R18.1
  Bottom 0.406: X3.A6 22.86,12.7 24.77,14.61 R19.2 33.66,13.97 v39.37,13.97
N$28
  Top 0.254: IC1.18 65.97,18.34 62.87,15.24 62.87,13.8 D8.C 60.66,12.53 D10.A 58.63,12.87 R13.1 C4.1
N$29
  Top 0.406: LED5.A 23.5,12.06 22.39,13.16 T5.3
  Top 0.61: R19.1 T5.3
N$30
  Top 0.254: R18.2 LED5.C
N$31  (via drill 0.5)
  Top 0.254: D9.C 24.75,15.71 T5.2 | R17.2 35.17,15.71
  Top 0.406: X3.A5 17.78,15.24 19.05,16.51 22.86,16.51 23.82,15.55 T5.2 | R17.2 34.71,16.51 v33.02,16.51 32.22,15.71 D9.C
  Top 0.61: R23.2 R22.1
  Bottom 0.406: R23.2 44.45,17.14 42.55,15.24 34.29,15.24 v33.02,16.51
N$32
  Top 0.254: IC1.30 76.05,19.84 77.47,18.41 C15.1 | C15.1 77.69,17.78 | 78.74,14.61 80.64,14.61 R60.1 | 78.74,14.61 78.74,17.14 77.89,18 C15.1 | 78.74,14.61 78.63,14.61 R61.1
N$33
  Top 0.254: IC1.14 64.33,20.34 D12.C 60.66,17.61 D14.A 58.63,17.95 R21.1 C6.1
N$34  (via drill 0.25)
  Top 0.254: IC1.15 64.92,19.84 61.59,16.51 v60.96,16.51 | R24.1 v55.24,15.24
  Bottom 0.254: v55.24,15.24 55.88,15.88 60.33,15.88 v60.96,16.51
N$35  (via drill 0.25)
  Top 0.254: T6.1 46.34,16.05 D11.A 47.62,15.88 v48.51,15.88 | R24.2 50.59,15.88 v50.16,15.88
  Bottom 0.254: v48.51,15.88 v50.16,15.88
N$36
  Top 0.406: LED6.A 45.09,14.61 43.98,15.71 T6.3
  Top 0.61: R23.1 T6.3
N$37
  Top 0.254: R22.2 49.31,16.5 LED6.C
N$38  (via drill 0.5)
  Top 0.254: T6.2 46.34,18.25 D11.C 56.77,18.25 R21.2
  Top 0.406: R27.2 R26.1 | v39.37,19.05 44.45,19.05 45.41,18.09 T6.2
  Bottom 0.406: v39.37,19.05 33.66,19.05 R27.2 24.77,19.68 22.86,17.78 X3.A4
N$39  (via drill 0.25)
  Top 0.254: v76.2,12.06 76.83,11.43 80.64,11.43 | 80.64,11.43 R60.2 | IC1.29 75.91,19.34 76.2,19.05 v76.2,15.24 | 80.64,11.43 v83.82,11.43 | v92.71,11.43 C16.2
  Bottom 0.254: v76.2,12.06 v76.2,15.24 | v83.82,11.43 v92.71,11.43 92.71,12.06 T2B.1
N$40  (via drill 0.25)
  Top 0.254: IC1.12 62.45,21.34 D16.A 60.66,20.49 D14.C 60.16,20.15 59.69,19.68 v57.78,19.68 | C7.1 37.08,18.58 v37.08,19.68 37.08,20.66 R25.1
  Bottom 0.254: v37.08,19.68 v57.78,19.68
N$41  (via drill 0.25)
  Top 0.254: IC1.13 63.38,20.84 61.59,19.05 v60.96,19.05 | R28.1 v32.38,17.78
  Bottom 0.254: v60.96,19.05 40.64,19.05 39.37,17.78 v32.38,17.78
N$42  (via drill 0.25)
  Top 0.254: T7.1 24.75,18.59 D13.A 26.04,18.41 v26.92,18.41 | v28.57,18.41 29,18.41 R28.2
  Bottom 0.254: v26.92,18.41 v28.57,18.41
N$43
  Top 0.406: R27.1 T7.3 22.39,18.25 23.5,17.14 LED7.A
N$44
  Top 0.254: R26.2 LED7.C
N$45  (via drill 0.5)
  Top 0.254: D13.C 24.75,20.79 T7.2
  Top 0.406: X3.A3 17.78,20.32 19.05,21.59 22.86,21.59 23.82,20.64 T7.2 | D13.C 32.22,20.79 v33.02,21.59 34.71,21.59 R25.2
  Top 0.61: R31.2 R30.1
  Bottom 0.406: R31.2 45.09,22.23 43.18,20.32 34.29,20.32 v33.02,21.59
N$46  (via drill 0.25)
  Top 0.254: JP3.2 66.04,5.71 66.04,8.26 v69.85,12.06 | v70.48,22.86 70.97,23.34 IC1.37
  Bottom 0.254: v69.85,12.06 70.48,12.7 v70.48,22.86
N$47
  Top 0.254: IC1.10 61.95,22.34 D16.C 60.66,22.69 D18.A 58.63,23.03 | 58.63,23.03 R29.1 | C8.1 58.63,23.03
N$48  (via drill 0.25)
  Top 0.254: IC1.11 61.84,21.84 61.59,21.59 v60.96,21.59 | R32.1 v55.24,20.32
  Bottom 0.254: v55.24,20.32 55.88,20.95 60.33,20.95 v60.96,21.59
N$49  (via drill 0.25)
  Top 0.254: T8.1 46.34,21.12 D15.A 47.62,20.95 v48.51,20.95 | R32.2 50.59,20.95 v50.16,20.95
  Bottom 0.254: v48.51,20.95 v50.16,20.95
N$50
  Top 0.406: LED8.A 45.09,19.68 43.98,20.79 T8.3
  Top 0.61: R31.1 T8.3
N$51
  Top 0.254: 49.53,20.32 49.53,19.91 LED8.C 49.31,21.59 R30.2
N$52  (via drill 0.5)
  Top 0.254: T8.2 46.34,23.32 D15.C 56.47,23.32 R29.2
  Top 0.406: R35.2 R34.1 | T8.2 45.41,23.18 44.45,24.13 v39.37,24.13
  Bottom 0.406: X3.A2 22.86,22.86 24.77,24.77 R35.2 33.66,24.13 v39.37,24.13
N$53  (via drill 0.25)
  Top 0.254: JP4.2 70.48,4.45 66.04,4.45 65.41,5.08 65.41,8.89 v69.85,13.34 | v69.85,24.77 70.83,23.84 IC1.38
  Bottom 0.254: v69.85,13.34 v69.85,24.77
N$54  (via drill 0.25)
  Top 0.254: IC1.8 63.83,23.34 D20.A 60.66,25.57 D18.C 60.16,25.23 59.69,24.77 v57.78,24.77 | C9.1 37.08,23.66 v37.08,24.77 37.08,25.87 R33.1
  Bottom 0.254: v37.08,24.77 v57.78,24.77
N$55  (via drill 0.25, 0.5)
  Top 0.254: IC1.9 62.88,22.84 61.59,24.13 v60.96,24.13 | R36.1 v32.38,22.86
  Bottom 0.254: v60.96,24.13 40.64,24.13 39.37,22.86 v32.38,22.86
N$56  (via drill 0.25)
  Top 0.254: T9.1 24.75,23.66 D17.A 26.2,23.5 v26.92,23.5 | v28.57,23.5 29,23.5 R36.2
  Bottom 0.254: v26.92,23.5 v28.57,23.5
N$57
  Top 0.406: R35.1 T9.3 22.39,23.32 23.5,22.23 LED9.A
N$58
  Top 0.254: R34.2 LED9.C
N$59  (via drill 0.5)
  Top 0.406: X3.A1 17.78,25.4 19.05,26.67 22.86,26.67 23.82,25.71 T9.2 24.75,25.86 D17.C 32.22,25.86 v33.02,26.67 34.71,26.67 R33.2
  Top 0.61: R39.2 R38.1
  Bottom 0.406: R39.2 45.09,27.3 43.18,25.4 34.29,25.4 v33.02,26.67
N$60  (via drill 0.25)
  Top 0.254: IC1.39 71.55,24.34 v71.12,24.77 | v72.39,10.16 73.03,9.53 79.38,9.53 80.01,8.89 80.01,7.62 79.38,6.99 76.2,6.99 JP5.2
  Bottom 0.254: v72.39,10.16 71.12,11.43 v71.12,24.77
N$61
  Top 0.254: IC1.6 65.03,24.34 D20.C 60.66,27.77 D22.A 58.63,28.11 R37.1 C10.1
N$62  (via drill 0.25)
  Top 0.254: IC1.7 64.42,23.84 61.59,26.67 v60.96,26.67 | R40.1 v55.24,25.4
  Bottom 0.254: v55.24,25.4 55.88,26.04 60.33,26.04 v60.96,26.67
N$63  (via drill 0.25)
  Top 0.254: T10.1 46.34,26.2 D19.A 47.62,26.04 v48.51,26.04 | v50.16,26.04 50.59,26.04 R40.2
  Bottom 0.254: v48.51,26.04 v50.16,26.04
N$64
  Top 0.406: LED10.A 45.09,24.77 43.81,26.04 43.81,27.14 T10.3
  Top 0.61: R39.1 T10.3
N$65
  Top 0.254: R38.2 49.31,26.66 LED10.C
N$66  (via drill 0.5)
  Top 0.254: T10.2 46.34,28.41 D19.C 56.47,28.41 R37.2
  Top 0.406: T10.2 45.41,28.25 44.45,29.21 v39.37,29.21 | R43.2 R42.1
  Bottom 0.406: X2.A3 15.88,29.84 17.78,27.94 22.86,27.94 24.77,29.84 R43.2 33.66,29.21 v39.37,29.21
N$67  (via drill 0.25)
  Top 0.254: JP6.2 78.74,5.71 80.64,7.62 80.64,8.89 79.38,10.16 73.66,10.16 v72.39,11.43 | v71.75,25.4 72.31,24.84 IC1.40
  Bottom 0.254: v72.39,11.43 71.75,12.06 v71.75,25.4
N$68  (via drill 0.25)
  Top 0.254: IC1.4 66.1,25.34 61.59,29.84 D24.A 60.66,30.65 D22.C 60.16,30.31 59.69,29.84 v57.78,29.84 | C11.1 37.08,28.87 v37.08,29.84 37.08,30.95 R41.1
  Bottom 0.254: v37.08,29.84 v57.78,29.84
N$69  (via drill 0.25)
  Top 0.254: IC1.5 65.97,24.84 61.59,29.21 v60.96,29.21 | R44.1 v32.38,27.94
  Bottom 0.254: v60.96,29.21 40.64,29.21 39.37,27.94 v32.38,27.94
N$70  (via drill 0.25)
  Top 0.254: T11.1 24.75,28.75 D21.A 26.2,28.57 v26.92,28.57 | v28.57,28.57 29,28.57 R44.2
  Bottom 0.254: v26.92,28.57 v28.57,28.57
N$71
  Top 0.406: R43.1 T11.3 22.39,28.41 23.5,27.3 LED11.A
N$72
  Top 0.254: R42.2 LED11.C
N$74  (via drill 0.25)
  Top 0.254: IC1.43 77.17,26.34 v77.47,26.04 | v87.63,21.59 IC2.11 R49.1
  Bottom 0.254: v77.47,26.04 77.47,22.86 78.74,21.59 v87.63,21.59
N$75
  Top 0.254: IC1.2 66.37,26.34 63.5,29.21 63.5,31.11 61.77,32.85 D24.C 61.59,33.66 R45.1 C12.1
N$76  (via drill 0.25)
  Top 0.254: IC1.3 66.23,25.84 62.87,29.21 62.87,30.48 61.59,31.75 v60.96,31.75 | R48.1 v55.24,30.48
  Bottom 0.254: v55.24,30.48 55.88,31.11 60.33,31.11 v60.96,31.75
N$77  (via drill 0.25)
  Top 0.254: T12.1 46.34,31.29 D23.A 47.62,31.11 v48.51,31.11 | R48.2 50.59,31.11 v50.16,31.11
  Bottom 0.254: v48.51,31.11 v50.16,31.11
N$78
  Top 0.406: LED12.A 45.09,29.84 43.98,30.95 T12.3
  Top 0.61: R47.1 T12.3
N$79
  Top 0.254: R46.2 49.31,31.75 LED12.C
N$80
  Top 0.406: X2.A1 17.14,34.92 18.41,33.66 25.02,33.66 L1.2
N$81  (via drill 0.25)
  Top 0.254: IC1.44 77.94,26.84 v78.11,26.67 | v88.9,22.23 IC2.12 R54.1
  Bottom 0.254: v78.11,26.67 78.11,23.5 79.38,22.23 v88.9,22.23
N$82  (via drill 0.25)
  Top 0.254: IC1.42 76.39,25.84 v76.83,25.4 | v90.17,20.95 IC2.13 R53.1
  Bottom 0.254: v76.83,25.4 76.83,22.23 78.11,20.95 v90.17,20.95
N$83  (via drill 0.25)
  Top 0.254: IC1.41 75.62,25.34 v76.2,24.77 | v91.44,20.32 IC2.14 R55.1
  Bottom 0.254: v76.2,24.77 76.2,21.59 77.47,20.32 v91.44,20.32
N$84  (via drill 0.5)
  Top 0.406: X2.A2 22.23,32.38 23.82,30.8 T11.2 24.75,30.95 D21.C 32.22,30.95 v33.02,31.75 34.71,31.75 R41.2
  Top 0.61: R47.2 R46.1
  Bottom 0.406: R47.2 45.09,32.38 43.18,30.48 34.29,30.48 v33.02,31.75
N$85  (via drill 0.25)
  Top 0.254: IC1.32 72.91,20.84 v72.39,20.32 | v74.3,10.79 80.01,10.79 80.64,10.16 83.19,10.16 85.09,8.26 85.09,6.35 84.45,5.71 JP2.2
  Bottom 0.254: v72.39,20.32 72.39,12.7 v74.3,10.79
N$86  (via drill 0.25)
  Top 0.254: v90.81,12.7 90.81,10.96 T13.3 | C18.2 IC2.9 v85.09,19.68 | v92.71,19.68 IC2.15 92.71,15.46 C19.1
  Bottom 0.254: 90.81,19.68 v92.71,19.68 | v90.81,12.7 90.81,19.68 | 90.81,19.68 v85.09,19.68
N$87
  Top 0.254: IC1.35 78.64,22.34 R59.1
N$88
  Top 0.254: IC1.36 76.42,22.84 R58.1
N$89
  Top 0.254: OK2.3 81.92,13.97 83.82,12.06 85.94,12.06 R52.1 88.35,11.83 T13.1 88.14,11.45
N$90
  Top 0.254: IC2.6 87.63,29.04 D28.C
N$92  (via drill 0.25)
  Top 0.254: IC2.3 v91.44,31.11
  Bottom 0.254: v91.44,31.11 88.9,31.11 87.63,32.38 CON1.7
N$93  (via drill 0.25)
  Top 0.254: v87.63,31.11 88.9,29.84 IC2.5
  Bottom 0.254: v87.63,31.11 83.19,31.11 CON1.3
N$94  (via drill 0.25)
  Top 0.254: v90.81,29.84 90.81,28.57 90.17,27.94 IC2.4
  Bottom 0.254: v90.81,29.84 90.17,30.48 81.92,30.48 80.01,32.38 CON1.1
N$95
  Top 0.254: CON1.9 90.17,31.75 90.17,29.38 D28.A
N$96
  Top 0.254: OK2.1 83.19,27.09 R50.2
N$98
  Top 0.254: IC1.1 67.31,26.84 R51.2 69.64,29 C21.1
N$100
  Top 0.254: R45.2 56.77,33.48 D23.C 46.34,33.48 T12.2 46.19,34.92 62.44,34.92 D27.C D26.1 | D26.1 D25.1 | D26.1 R51.1
  Top 0.406: T12.2 45.41,33.34 44.45,34.29 40.64,34.29 40.01,33.66 28.32,33.66 L1.1
N$103  (via drill 0.25)
  Top 0.254: IC1.25 71.31,17.34 v63.5,9.53 | v63.5,2.54 62.23,1.27 32.6,1.27 R4.1
  Bottom 0.254: v63.5,2.54 v63.5,9.53
VCC  (via drill 0.25)
  Top 0.254: IC1.33 75.81,21.34 76.2,20.95 76.2,20.32 | IC1.31 76.18,20.34 76.2,20.32 | 80.01,18.03 R59.2 R57.2 76.85,19.67 76.2,20.32 | IC2.16 93.98,13.76 C19.2 92.71,13.96 R55.2 R53.2 R54.2 R49.2 87.61,13.97 86.36,13.97 | C18.1 85.09,13.97 | 86.36,13.97 IC2.10 | C18.1 83.4,13.76 v82.55,14.61 83.19,15.24 OK2.4 83.19,21.59 82.55,22.23 80.01,22.23 79.38,22.86 78.49,22.86 78.49,22.88 R58.2 | C18.1 85.31,13.97 86.36,13.97 | v80.9,18.03 80.01,18.03 | 80.01,18.03 C14.2
  Bottom 0.254: JP3.3 JP4.3 JP5.3 JP6.3 JP2.3 v82.55,14.61 82.55,16.38 v80.9,18.03
(copper drawn outside any net)
  shapes: Bottom circle x3, Top circle x3

### Text on the board
Bottom: Markus Walser | 2011
tPlace: Supervisor Rev 1.0 | T2 | A0 | A1 | A2 | A3 | TOS | T1 | Energex | C1
tDocu: SPI